# Altium schematic sheet BusViewer.SchDoc: z80 Single Board Computer: Bus Data Visualizer
size A4; DrawnBy: Naoki Pross; DocumentNumber: 4; SheetNumber: 4; SheetTotal: 4
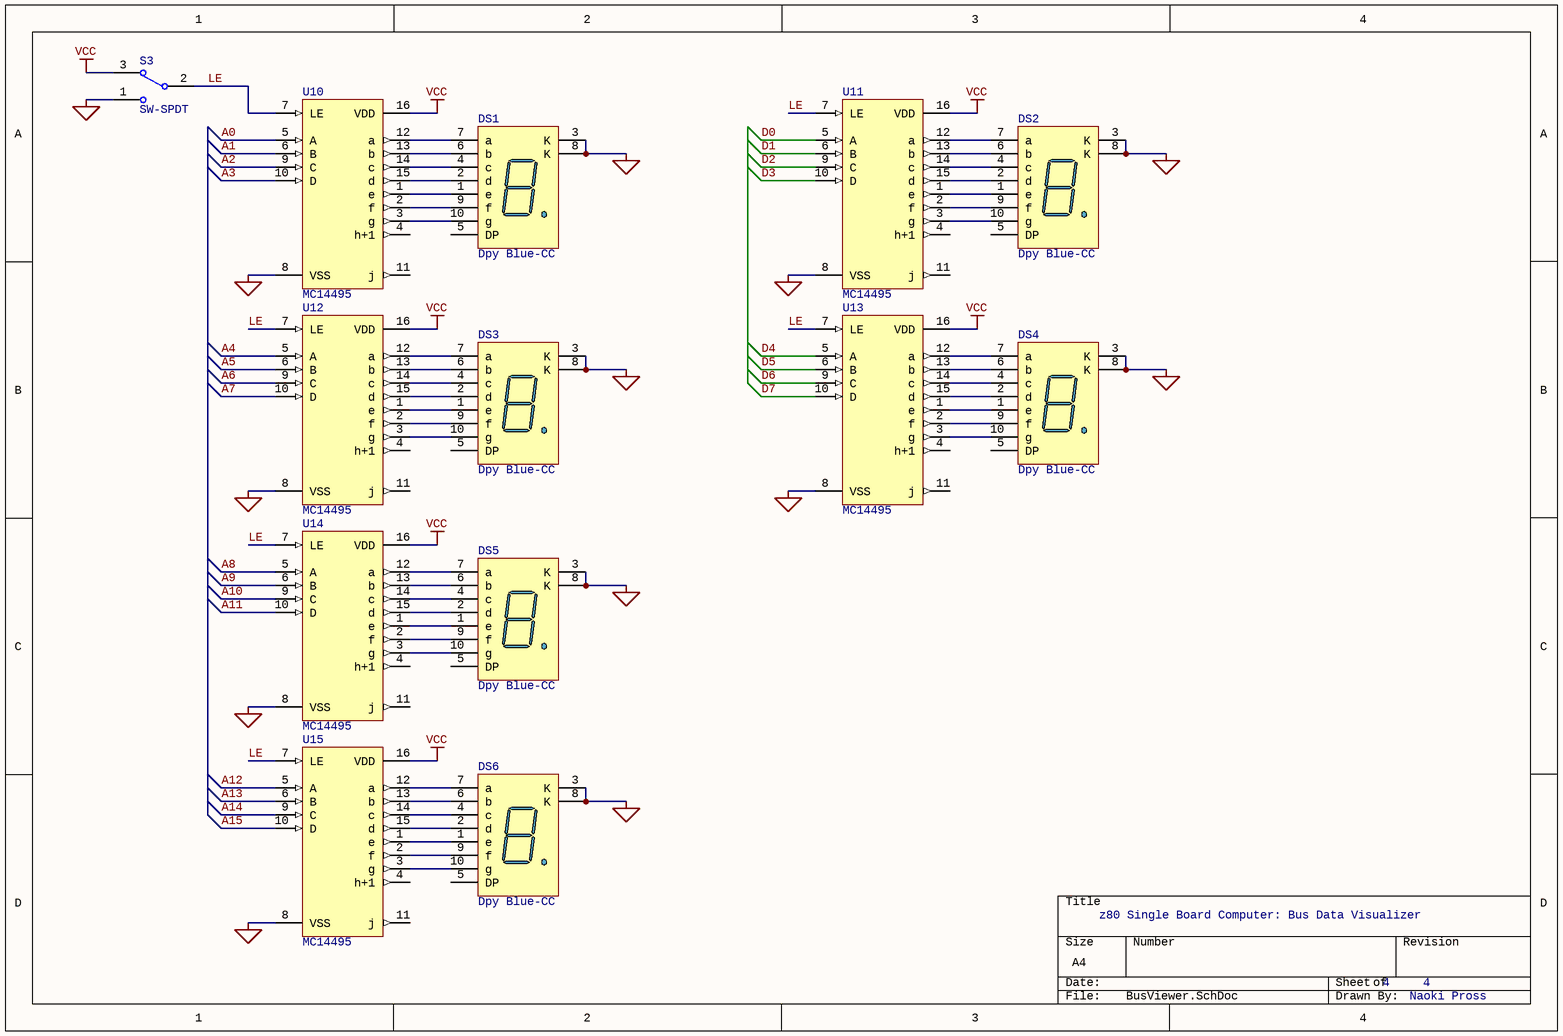
[diagram p0: BusViewer.SchDoc]

## Parts
DS1  Dpy Blue-CC  [H]
DS2  Dpy Blue-CC  [H]
DS3  Dpy Blue-CC  [H]
DS4  Dpy Blue-CC  [H]
DS5  Dpy Blue-CC  [H]
DS6  Dpy Blue-CC  [H]
S3  SW-SPDT  [SW_2WAY]
U10  MC14495  [DIP16]
U11  MC14495  [DIP16]
U12  MC14495  [DIP16]
U13  MC14495  [DIP16]
U14  MC14495  [DIP16]
U15  MC14495  [DIP16]

## Nets
GND: DS1.3(K) DS1.8(K) DS2.3(K) DS2.8(K) DS3.3(K) DS3.8(K) DS4.3(K) DS4.8(K) DS5.3(K) DS5.8(K) DS6.3(K) DS6.8(K) S3.1 U10.8(VSS) U11.8(VSS) U12.8(VSS) U13.8(VSS) U14.8(VSS) U15.8(VSS)
VCC: S3.3 U10.16(VDD) U11.16(VDD) U12.16(VDD) U13.16(VDD) U14.16(VDD) U15.16(VDD)
A0: U10.5(A)
A1: U10.6(B)
A2: U10.9(C)
A3: U10.10(D)
A4: U12.5(A)
A5: U12.6(B)
A6: U12.9(C)
A7: U12.10(D)
A8: U14.5(A)
A9: U14.6(B)
A10: U14.9(C)
A11: U14.10(D)
A12: U15.5(A)
A13: U15.6(B)
A14: U15.9(C)
A15: U15.10(D)
D0: U11.5(A)
D1: U11.6(B)
D2: U11.9(C)
D3: U11.10(D)
D4: U13.5(A)
D5: U13.6(B)
D6: U13.9(C)
D7: U13.10(D)
LE: S3.2 U10.7(LE) U11.7(LE) U12.7(LE) U13.7(LE) U14.7(LE) U15.7(LE)
NetDS1_1: DS1.1(e) U10.1(e)
NetDS1_2: DS1.2(d) U10.15(d)
NetDS1_4: DS1.4(c) U10.14(c)
NetDS1_6: DS1.6(b) U10.13(b)
NetDS1_7: DS1.7(a) U10.12(a)
NetDS1_9: DS1.9(f) U10.2(f)
NetDS1_10: DS1.10(g) U10.3(g)
NetDS2_1: DS2.1(e) U11.1(e)
NetDS2_2: DS2.2(d) U11.15(d)
NetDS2_4: DS2.4(c) U11.14(c)
NetDS2_6: DS2.6(b) U11.13(b)
NetDS2_7: DS2.7(a) U11.12(a)
NetDS2_9: DS2.9(f) U11.2(f)
NetDS2_10: DS2.10(g) U11.3(g)
NetDS3_1: DS3.1(e) U12.1(e)
NetDS3_2: DS3.2(d) U12.15(d)
NetDS3_4: DS3.4(c) U12.14(c)
NetDS3_6: DS3.6(b) U12.13(b)
NetDS3_7: DS3.7(a) U12.12(a)
NetDS3_9: DS3.9(f) U12.2(f)
NetDS3_10: DS3.10(g) U12.3(g)
NetDS4_1: DS4.1(e) U13.1(e)
NetDS4_2: DS4.2(d) U13.15(d)
NetDS4_4: DS4.4(c) U13.14(c)
NetDS4_6: DS4.6(b) U13.13(b)
NetDS4_7: DS4.7(a) U13.12(a)
NetDS4_9: DS4.9(f) U13.2(f)
NetDS4_10: DS4.10(g) U13.3(g)
NetDS5_1: DS5.1(e) U14.1(e)
NetDS5_2: DS5.2(d) U14.15(d)
NetDS5_4: DS5.4(c) U14.14(c)
NetDS5_6: DS5.6(b) U14.13(b)
NetDS5_7: DS5.7(a) U14.12(a)
NetDS5_9: DS5.9(f) U14.2(f)
NetDS5_10: DS5.10(g) U14.3(g)
NetDS6_1: DS6.1(e) U15.1(e)
NetDS6_2: DS6.2(d) U15.15(d)
NetDS6_4: DS6.4(c) U15.14(c)
NetDS6_6: DS6.6(b) U15.13(b)
NetDS6_7: DS6.7(a) U15.12(a)
NetDS6_9: DS6.9(f) U15.2(f)
NetDS6_10: DS6.10(g) U15.3(g)

Not connected (* = marked no-connect by the designer): DS1 5(DP); DS2 5(DP); DS3 5(DP); DS4 5(DP); DS5 5(DP); DS6 5(DP); U10 4(h+1) 11(j); U11 4(h+1) 11(j); U12 4(h+1) 11(j); U13 4(h+1) 11(j); U14 4(h+1) 11(j); U15 4(h+1) 11(j)

## Library data of the parts
DS1-DS6 = Dpy Blue-CC: 14.2 mm General Purpose Blue 7-Segment Display: CC, RH DP, Gray Surface; MinimumIntensity: 2020 ucd; Note: IF = 10 mA; Published: 8-Jun-2000; LatestRevisionDate: 17-Dec-2003; LatestRevisionNote: Schematic revised, PCB Footprint replaced.; DatasheetVersion: 24-Sep-2002; PackageVersion: 24-Sep-2002; PackageReference: H; Publisher: Altium Limited; PackageDescription: LED, 7-Segment Display, 14.2 mm, RHD; 10 Leads; Row Space 15.24 mm; Pitch 2.54 mm; Colour: Blue; ComponentLink1Description: Manufacturer Link; ComponentLink1URL: http://www.agilent.com/
S3 = SW-SPDT: SPDT Subminiature Toggle Switch, Right Angle Mounting, Vertical Actuation; Published: 24-Mar-1999; LatestRevisionDate: 17-Dec-2003; LatestRevisionNote: Schematic revised, PCB Footprint replaced.; DatasheetVersion: 05-Dec-2000; PackageReference: TL36WW15050; Publisher: Altium Limited; PackageDescription: Switch; 4 Leads; ComponentLink1Description: Manufacturer Link; ComponentLink1URL: http://www.apem.com
U10-U15 = MC14495: Hexadecimal to seven segment Latch / Decoder LED Driver